# Altium schematic sheet W9825G6KH-61_W9825G6KH-6.schdoc
size 127 x 99 mm
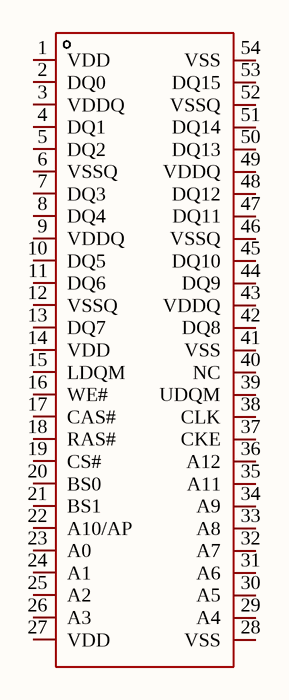
[diagram p0: W9825G6KH-61_W9825G6KH-6.schdoc]

## Parts
U?  W9825G6KH-6  [TSOP-54_L22.2-W10.2-P0.80-LS11.8-BL]  (value not drawn)

## Nets

Not connected (* = marked no-connect by the designer): U? 1(VDD) 2(DQ0) 3(VDDQ) 4(DQ1) 5(DQ2) 6(VSSQ) 7(DQ3) 8(DQ4) 9(VDDQ) 10(DQ5) 11(DQ6) 12(VSSQ) 13(DQ7) 14(VDD) 15(LDQM) 16(WE#) 17(CAS#) 18(RAS#) 19(CS#) 20(BS0) 21(BS1) 22(A10/AP) 23(A0) 24(A1) 25(A2) 26(A3) 27(VDD) 28(VSS) 29(A4) 30(A5) 31(A6) 32(A7) 33(A8) 34(A9) 35(A11) 36(A12) 37(CKE) 38(CLK) 39(UDQM) 40(NC) 41(VSS) 42(DQ8) 43(VDDQ) 44(DQ9) 45(DQ10) 46(VSSQ) 47(DQ11) 48(DQ12) 49(VDDQ) 50(DQ13) 51(DQ14) 52(VSSQ) 53(DQ15) 54(VSS)

## Library data of the parts
U? = W9825G6KH-6: Manufacturer: Winbond(华邦); Add into BOM: yes; Memory Size: 256Mbit; Clock Frequency: 166MHz; Voltage - Supply: 3V~3.6V; Symbol: W9825G6KH-6; Device: W9825G6KH-6; LCSC Part Name: 4M×4存储体×16位SDRAM; Supplier Part: C62246; Manufacturer Part: W9825G6KH-6; Supplier Footprint: TSOP-54-10.2mm; JLCPCB Part Class: Extended Part; Datasheet: https://item.szlcsc.com/datasheet/W9825G6KH-6/63303.html; Supplier: LCSC; Convert to PCB: yes; Operating Temperature: 0℃~+70℃